# EAGLE schematic esp32 t1 (EAGLE 9.6.2)
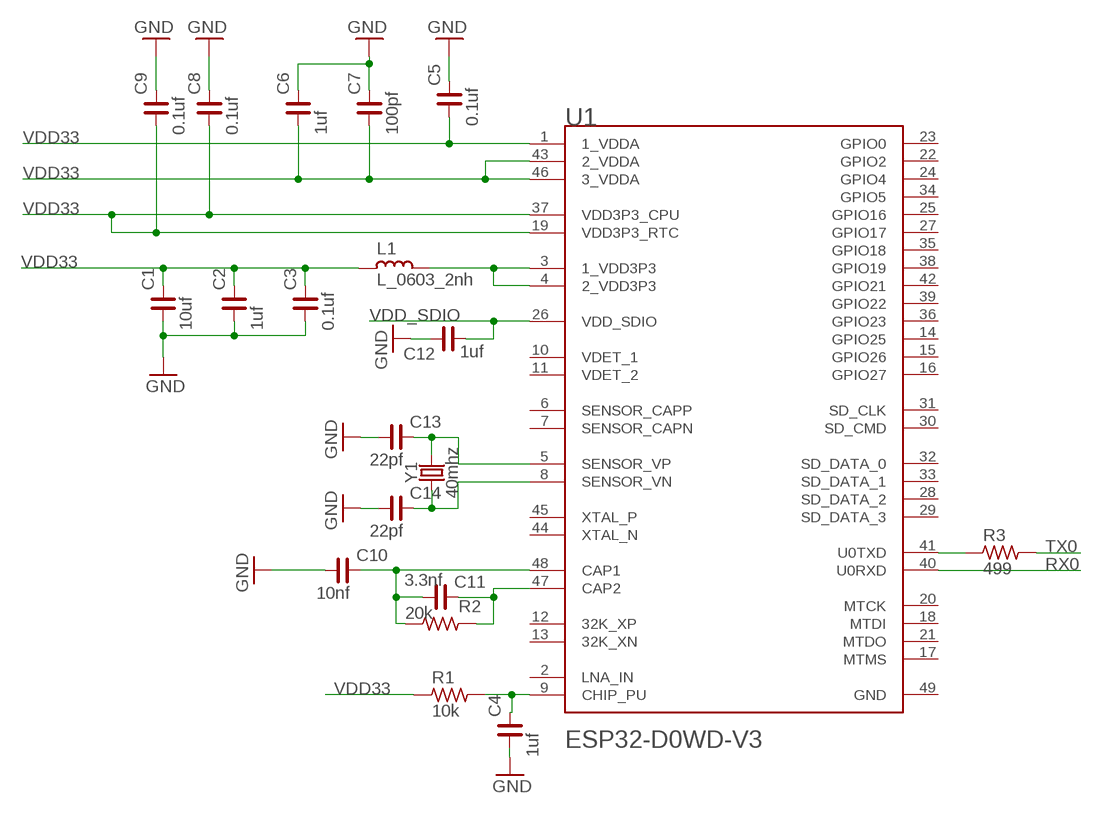
[diagram p0: schematic, sheet 1]

## Parts
C1  10uf  C_0603  [C0603]
C2  1uf  C_0603  [C0603]
C3  0.1uf  C_0603  [C0603]
C4  1uf  C_0603  [C0603]
C5  0.1uf  C_0603  [C0603]
C6  1uf  C_0603  [C0603]
C7  100pf  C_0603  [C0603]
C8  0.1uf  C_0603  [C0603]
C9  0.1uf  C_0603  [C0603]
C10  10nf  C_0603  [C0603]
C11  3.3nf  C_0603  [C0603]
C12  1uf  C_0603  [C0603]
C13  22pf  C_0603  [C0603]
C14  22pf  C_0603  [C0603]
L1  L_0603_2nh  L_0603  [L0603]
R1  10k  R_0603  [R0603]
R2  20k  R_0603  [R0603]
R3  499  R_0603  [R0603]
U1  ESPRESSIF_SYSTEMS_ESP32-D0WD-V3ESPRESSIF_SYSTEMS_ESP32-D0WD-V3_0_0  [ESPRESSIF_SYSTEMS_ESP32-D0WD-V3_0]
Y1  40mhz  CRYSTALSMD-3.2X1.5  [CRYSTAL-SMD-3.2X1.5MM]

## Nets
GND: C1.1 C2.1 C3.1 C4.1 C5.2 C6.2 C7.2 C8.2 C9.2 C10.1 C12.2 C13.1 C14.1
N$1: C4.2 R1.2 U1.9(CHIP_PU)
N$2: L1.1 U1.3(1_VDD3P3) U1.4(2_VDD3P3)
N$3: C10.2 C11.1 R2.1 U1.48(CAP1)
N$4: C11.2 R2.2 U1.47(CAP2)
N$5: C13.2 U1.5(SENSOR_VP) Y1.P$2
N$6: R3.1 U1.41(U0TXD)
N$7: C14.2 U1.8(SENSOR_VN) Y1.P$1
RX0: U1.40(U0RXD)
TX0: R3.2
VDD33: C1.2 C2.2 C3.2 C5.1 C6.1 C7.1 C8.1 C9.1 L1.2 R1.1 U1.1(1_VDDA) U1.19(VDD3P3_RTC) U1.37(VDD3P3_CPU) U1.43(2_VDDA) U1.46(3_VDDA)
VDD_SDIO: C12.1 U1.26(VDD_SDIO)
Unconnected: U1.2(LNA_IN) U1.6(SENSOR_CAPP) U1.7(SENSOR_CAPN) U1.12(32K_XP) U1.13(32K_XN) U1.14(GPIO25) U1.15(GPIO26) U1.16(GPIO27) U1.17(MTMS) U1.18(MTDI) U1.20(MTCK) U1.21(MTDO) U1.22(GPIO2) U1.23(GPIO0) U1.24(GPIO4) U1.25(GPIO16) U1.27(GPIO17) U1.28(SD_DATA_2) U1.29(SD_DATA_3) U1.30(SD_CMD) U1.31(SD_CLK) U1.32(SD_DATA_0) U1.33(SD_DATA_1) U1.34(GPIO5) U1.35(GPIO18) U1.36(GPIO23) U1.38(GPIO19) U1.39(GPIO22) U1.42(GPIO21) U1.44(XTAL_N) U1.45(XTAL_P)

## Power pins joined to a net without a drawn wire
GND: U1.49(GND)
VDET_1: U1.10(VDET_1)
VDET_2: U1.11(VDET_2)

## Library data of the parts
C1-C14 = rc-master-smd:C_: NON-POLARIZED CAP
L1 = rc-master-smd:L_: INDUCTOR
R1-R3 = rc-master-smd:R_: RESISTOR
U1 = ESP32-D0WD-V3:ESPRESSIF_SYSTEMS_ESP32-D0WD-V3: IC RF TxRx + MCU Bluetooth, WiFi 802.11b/g/n, Bluetooth 4.2 2.412GHz ~ 2.484GHz 48-VFQFN Exposed Pad; AUTOMOTIVE: No; BANDWIDTH: 72MHz; CENTROID_NOT_SPECIFIED: No; DATASHEET: https://www.espressif.com/sites/default/files/documentation/esp32_datasheet_en.pdf; DATA_RATE: 150Mbits/s; DEVICE_CLASS_L1: Integrated Circuits (ICs); DEVICE_CLASS_L2: RF Semiconductors and Devices; DEVICE_CLASS_L3: Transceivers; DIGIKEY_DESCRIPTION: IC RF TXRX+MCU BLUETOOTH WIFI; DIGIKEY_PART_NUMBER: 1904-ESP32-D0WD-V3CT-ND; FOOTPRINT_PARAMETERS_0: {"fp_type":"QFN","params":{"N1":{"nom":14,"long name":"Leads on long side","min":null,"max":null,"short name":"N1","type":"count"},"N2":{"nom":10,"long name":"Leads on wide side","min":null,"max":null,"short name":"N2","type":"count"},"A":{"nom":850000,"long name":"Height","min":800000,"max":900000,"short name":"A","type":"measurement"},"A1":{"nom":25000,"long name":"Package clearance","min":0,"max":50000,"short name":"A1","type":"measurement"},"A2":{"nom":825000,"long name":"Package height","min":750000,"max":900000,"short name":"A2","type":"measurement"},"D":{"nom":5000000,"long name":"Package length","min":4950000,"max":5050000,"short name":"D","type":"measurement"},"E":{"nom":5000000,"long name":"Package width","min":4950000,"max":5050000,"short name":"E","type":"measurement"},"B":{"nom":180000,"long name":"Lead width","min":130000,"max":230000,"short name":"B","type":"measurement"},"C":{"nom":203000,"long name":"Lead thickness","min":null,"max":null,"short name":"C","type":"measurement"},"L":{"nom":400000,"long name":"Lead foot length","min":350000,"max":450000,"short name":"L","type":"measurement"},"e":{"nom":350000,"long name":"Lead pitch","min":null,"max":null,"short name":"e","type":"measurement"},"D2":{"nom":3700000,"long name":"Thermal pad length","min":3650000,"max":3750000,"short name":"D2","type":"measurement"},"E2":{"nom":3700000,"long name":"Thermal pad width","min":3650000,"max":3750000,"short name":"E2","type":"measurement"},"PC":{"long name":"Paste coverage (%)","type":"percentage","short name":"PC","value":40},"HT":{"default":"Yes","long name":"Thermal pad","type":"multichoiceparent","short name":"HT","children":["D2","E2","PC"]},"offset x":{"nom":0,"long name":"X Center offset","min":null,"max":null,"short name":"offset x","type":"measurement"},"offset y":{"nom":0,"long name":"Y Center offset","min":null,"max":null,"short name":"offset y","type":"measurement"},"LS":{"default":"Rounded rectangle","long name":"Land shape","type":"multichoice","short name":"LS"},"LS1":{"default":"Rectangle","long name":"Land shape (Pin 1)","type":"multichoice","short name":"LS1"},"solder toe":{"nom":400000,"long name":"Solder fillet (toe)","min":null,"max":null,"short name":"solder toe","type":"fixedmeasurement"},"solder heel":{"nom":0,"long name":"Solder fillet (heel)","min":null,"max":null,"short name":"solder heel","type":"fixedmeasurement"},"solder side":{"nom":-40000,"long name":"Solder fillet (side)","min":null,"max":null,"short name":"solder side","type":"fixedmeasurement"},"courtyard":{"nom":500000,"long name":"Courtyard","min":null,"max":null,"short name":"courtyard","type":"fixedmeasurement"},"SF":{"default":"A","long name":"Packing level","type":"multichoiceparent","short name":"SF","help":"http://support.upverter.com/customer/portal/articles/978783-what-is-a-footprint-packing-level","children":["solder toe","solder heel","solder side","courtyard"]}}}; FOOTPRINT_PARAMETERS_1: {"fp_type":"QFN","params":{"N1":{"nom":14,"long name":"Leads on long side","min":null,"max":null,"short name":"N1","type":"count"},"N2":{"nom":10,"long name":"Leads on wide side","min":null,"max":null,"short name":"N2","type":"count"},"A":{"nom":850000,"long name":"Height","min":800000,"max":900000,"short name":"A","type":"measurement"},"A1":{"nom":25000,"long name":"Package clearance","min":0,"max":50000,"short name":"A1","type":"measurement"},"A2":{"nom":825000,"long name":"Package height","min":750000,"max":900000,"short name":"A2","type":"measurement"},"D":{"nom":5000000,"long name":"Package length","min":4950000,"max":5050000,"short name":"D","type":"measurement"},"E":{"nom":5000000,"long name":"Package width","min":4950000,"max":5050000,"short name":"E","type":"measurement"},"B":{"nom":180000,"long name":"Lead width","min":130000,"max":230000,"short name":"B","type":"measurement"},"C":{"nom":203000,"long name":"Lead thickness","min":null,"max":null,"short name":"C","type":"measurement"},"L":{"nom":400000,"long name":"Lead foot length","min":350000,"max":450000,"short name":"L","type":"measurement"},"e":{"nom":350000,"long name":"Lead pitch","min":null,"max":null,"short name":"e","type":"measurement"},"D2":{"nom":3700000,"long name":"Thermal pad length","min":3650000,"max":3750000,"short name":"D2","type":"measurement"},"E2":{"nom":3700000,"long name":"Thermal pad width","min":3650000,"max":3750000,"short name":"E2","type":"measurement"},"PC":{"long name":"Paste coverage (%)","type":"percentage","short name":"PC","value":40},"HT":{"default":"Yes","long name":"Thermal pad","type":"multichoiceparent","short name":"HT","children":["D2","E2","PC"]},"offset x":{"nom":0,"long name":"X Center offset","min":null,"max":null,"short name":"offset x","type":"measurement"},"offset y":{"nom":0,"long name":"Y Center offset","min":null,"max":null,"short name":"offset y","type":"measurement"},"LS":{"default":"Rounded rectangle","long name":"Land shape","type":"multichoice","short name":"LS"},"LS1":{"default":"Rectangle","long name":"Land shape (Pin 1)","type":"multichoice","short name":"LS1"},"solder toe":{"nom":300000,"long name":"Solder fillet (toe)","min":null,"max":null,"short name":"solder toe","type":"fixedmeasurement"},"solder heel":{"nom":0,"long name":"Solder fillet (heel)","min":null,"max":null,"short name":"solder heel","type":"fixedmeasurement"},"solder side":{"nom":-40000,"long name":"Solder fillet (side)","min":null,"max":null,"short name":"solder side","type":"fixedmeasurement"},"courtyard":{"nom":250000,"long name":"Courtyard","min":null,"max":null,"short name":"courtyard","type":"fixedmeasurement"},"SF":{"default":"B","long name":"Packing level","type":"multichoiceparent","short name":"SF","help":"http://support.upverter.com/customer/portal/articles/978783-what-is-a-footprint-packing-level","children":["solder toe","solder heel","solder side","courtyard"]}}}; FOOTPRINT_PARAMETERS_2: {"fp_type":"QFN","params":{"N1":{"nom":14,"long name":"Leads on long side","min":null,"max":null,"short name":"N1","type":"count"},"N2":{"nom":10,"long name":"Leads on wide side","min":null,"max":null,"short name":"N2","type":"count"},"A":{"nom":850000,"long name":"Height","min":800000,"max":900000,"short name":"A","type":"measurement"},"A1":{"nom":25000,"long name":"Package clearance","min":0,"max":50000,"short name":"A1","type":"measurement"},"A2":{"nom":825000,"long name":"Package height","min":750000,"max":900000,"short name":"A2","type":"measurement"},"D":{"nom":5000000,"long name":"Package length","min":4950000,"max":5050000,"short name":"D","type":"measurement"},"E":{"nom":5000000,"long name":"Package width","min":4950000,"max":5050000,"short name":"E","type":"measurement"},"B":{"nom":180000,"long name":"Lead width","min":130000,"max":230000,"short name":"B","type":"measurement"},"C":{"nom":203000,"long name":"Lead thickness","min":null,"max":null,"short name":"C","type":"measurement"},"L":{"nom":400000,"long name":"Lead foot length","min":350000,"max":450000,"short name":"L","type":"measurement"},"e":{"nom":350000,"long name":"Lead pitch","min":null,"max":null,"short name":"e","type":"measurement"},"D2":{"nom":3700000,"long name":"Thermal pad length","min":3650000,"max":3750000,"short name":"D2","type":"measurement"},"E2":{"nom":3700000,"long name":"Thermal pad width","min":3650000,"max":3750000,"short name":"E2","type":"measurement"},"PC":{"long name":"Paste coverage (%)","type":"percentage","short name":"PC","value":40},"HT":{"default":"Yes","long name":"Thermal pad","type":"multichoiceparent","short name":"HT","children":["D2","E2","PC"]},"offset x":{"nom":0,"long name":"X Center offset","min":null,"max":null,"short name":"offset x","type":"measurement"},"offset y":{"nom":0,"long name":"Y Center offset","min":null,"max":null,"short name":"offset y","type":"measurement"},"LS":{"default":"Rounded rectangle","long name":"Land shape","type":"multichoice","short name":"LS"},"LS1":{"default":"Rectangle","long name":"Land shape (Pin 1)","type":"multichoice","short name":"LS1"},"solder toe":{"nom":200000,"long name":"Solder fillet (toe)","min":null,"max":null,"short name":"solder toe","type":"fixedmeasurement"},"solder heel":{"nom":0,"long name":"Solder fillet (heel)","min":null,"max":null,"short name":"solder heel","type":"fixedmeasurement"},"solder side":{"nom":-40000,"long name":"Solder fillet (side)","min":null,"max":null,"short name":"solder side","type":"fixedmeasurement"},"courtyard":{"nom":100000,"long name":"Courtyard","min":null,"max":null,"short name":"courtyard","type":"fixedmeasurement"},"SF":{"default":"C","long name":"Packing level","type":"multichoiceparent","short name":"SF","help":"http://support.upverter.com/customer/portal/articles/978783-what-is-a-footprint-packing-level","children":["solder toe","solder heel","solder side","courtyard"]}}}; FOOTPRINT_VARIANT_NAME_0: IPC_A; FOOTPRINT_VARIANT_NAME_1: IPC_B; FOOTPRINT_VARIANT_NAME_2: IPC_C; HEIGHT: 0.9mm; INTERFACE: I2C,SPI,UART,2-Wire,Ethernet,I2S,Other; IPC_LAND_PATTERN_NAME: QFN35P500X500X85-48; LEAD_FREE: Yes; MAX_FREQUENCY: 2484MHz; MAX_SUPPLY_VOLTAGE: 3.6V; MF: Espressif Systems; MFG_PACKAGE_IDENT: 0; MFG_PACKAGE_IDENT_DATE: 0; MFG_PACKAGE_IDENT_REV: 0; MIN_SUPPLY_VOLTAGE: 1.8V; MOUSER_PART_NUMBER: 356-ESP32-D0WD-V3; MPN: ESP32-D0WD-V3; NOMINAL_SUPPLY_CURRENT: 0.5A; NUMBER_OF_ADC_CHANNELS: 18; NUMBER_OF_GPIO: 34; PACKAGE: VFQFN48; PREFIX: U; RECEIVING_CURRENT: 100mA; ROHS: Yes; SENSITIVITY: -98dBm; STANDOFF_HEIGHT: 0mm; TEMPERATURE_RANGE_HIGH: +125°C; TEMPERATURE_RANGE_LOW: -40°C; TRANSMITTING_CURRENT: 240mA; VERIFICATION_VERSION: 0.0.0.3
Y1 = SparkFun-Clocks:CRYSTAL: Crystals (Generic) These are passive quartz crystals, which can be used as a clock source for a microcontroller. Crystal's are two-terminal devices. They require external "load" capacitors to generate an oscillating signal.